# Altium project pin-to-pin.PrjPcb
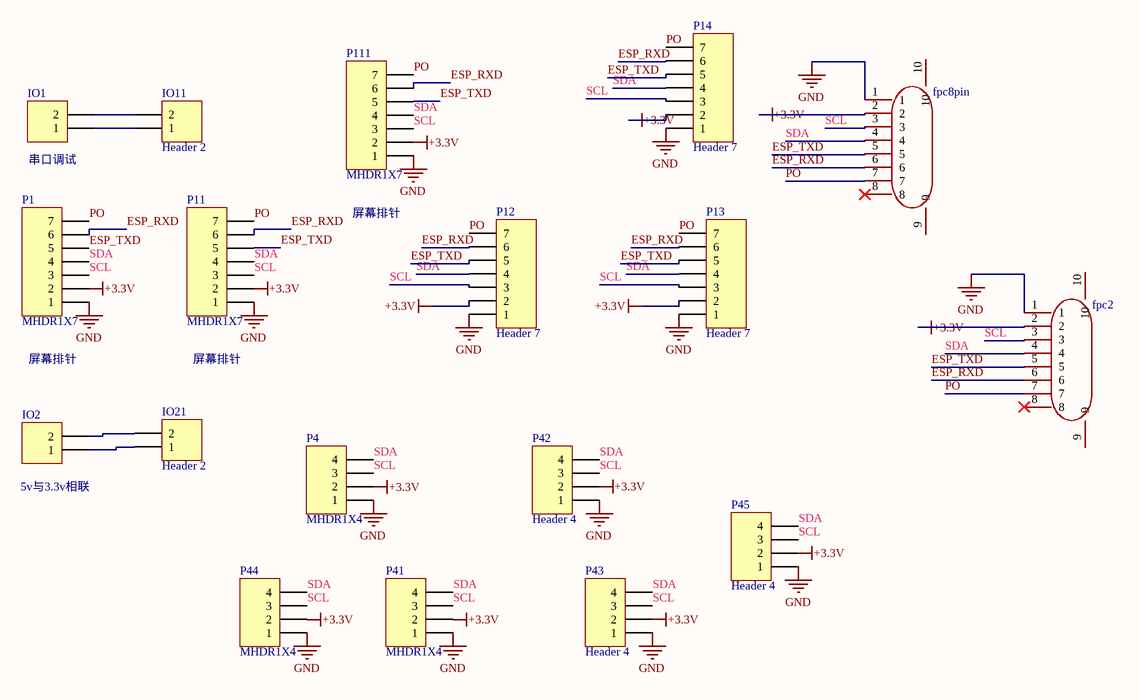
[diagram p0: pin.SchDoc]
1 sheet, 18 parts. Net scope: global (net labels, ports and power ports of the same name join across sheets).
Board file: pin.PcbDoc

## Sheet pin.SchDoc
size 400 x 289 mm

### Parts
fpc2  fpc8pin  [fpcpin8]  (value not drawn)
fpc8pin  fpc8pin  [fpcpin8]  (value not drawn)
IO1  串口调试  [MHDR1X2]
IO2  5v与3.3v相联  [MHDR1X2]
IO11  Header 2  [HDR1X2]
IO21  Header 2  [HDR1X2]
P1  MHDR1X7  [MHDR1X7]
P4  MHDR1X4  [MHDR1X4]
P11  MHDR1X7  [MHDR1X7]
P12  Header 7  [HDR1X7]
P13  Header 7  [HDR1X7]
P14  Header 7  [HDR1X7]
P41  MHDR1X4  [MHDR1X4]
P42  Header 4  [HDR1X4]
P43  Header 4  [HDR1X4]
P44  MHDR1X4  [MHDR1X4]
P45  Header 4  [HDR1X4]
P111  MHDR1X7  [MHDR1X7]

### Nets
+3.3V: fpc2.2 fpc8pin.2 P1.2 P4.2 P11.2 P12.2 P13.2 P14.2 P41.2 P42.2 P43.2 P44.2 P45.2 P111.2
GND: fpc2.1 fpc8pin.1 P1.1 P4.1 P11.1 P12.1 P13.1 P14.1 P41.1 P42.1 P43.1 P44.1 P45.1 P111.1
ESP_RXD: fpc2.6 fpc8pin.6 P1.6 P11.6 P12.6 P13.6 P14.6 P111.6
ESP_TXD: fpc2.5 fpc8pin.5 P1.5 P11.5 P12.5 P13.5 P14.5 P111.5
PO: fpc2.7 fpc8pin.7 P1.7 P11.7 P12.7 P13.7 P14.7 P111.7
SCL: fpc2.3 fpc8pin.3 P1.3 P4.3 P11.3 P12.3 P13.3 P14.3 P41.3 P42.3 P43.3 P44.3 P45.3 P111.3
SDA: fpc2.4 fpc8pin.4 P1.4 P4.4 P11.4 P12.4 P13.4 P14.4 P41.4 P42.4 P43.4 P44.4 P45.4 P111.4
NetIO1_1: IO1.1 IO11.1
NetIO1_2: IO1.2 IO11.2
NetIO2_1: IO2.1 IO21.1
NetIO2_2: IO2.2 IO21.2

Not connected (* = marked no-connect by the designer): fpc2 8* 9 10; fpc8pin 8* 9 10

### Notes on the sheet
- (near P111) 屏幕排针
- 屏幕排针

### Library data of the parts
IO1 IO2 IO11 IO21 = Header 2: Header, 2-Pin; LatestRevisionDate: 17-Jul-2002; LatestRevisionNote: Re-released for DXP Platform.; Publisher: Altium Limited
P1 P11 P111 = MHDR1X7: Header, 7-Pin; LatestRevisionDate: 17-Jul-2002; LatestRevisionNote: Re-released for DXP Platform.; Publisher: Altium Limited
P4 P41 P44 = MHDR1X4: Header, 4-Pin; LatestRevisionDate: 17-Jul-2002; LatestRevisionNote: Re-released for DXP Platform.; Publisher: Altium Limited
P12-P14 = Header 7: Header, 7-Pin; LatestRevisionDate: 17-Jul-2002; LatestRevisionNote: Re-released for DXP Platform.; Publisher: Altium Limited
P42 P43 P45 = Header 4: Header, 4-Pin; LatestRevisionDate: 17-Jul-2002; LatestRevisionNote: Re-released for DXP Platform.; Publisher: Altium Limited